# Altium project FOC_Controller_PCB.PrjPcb
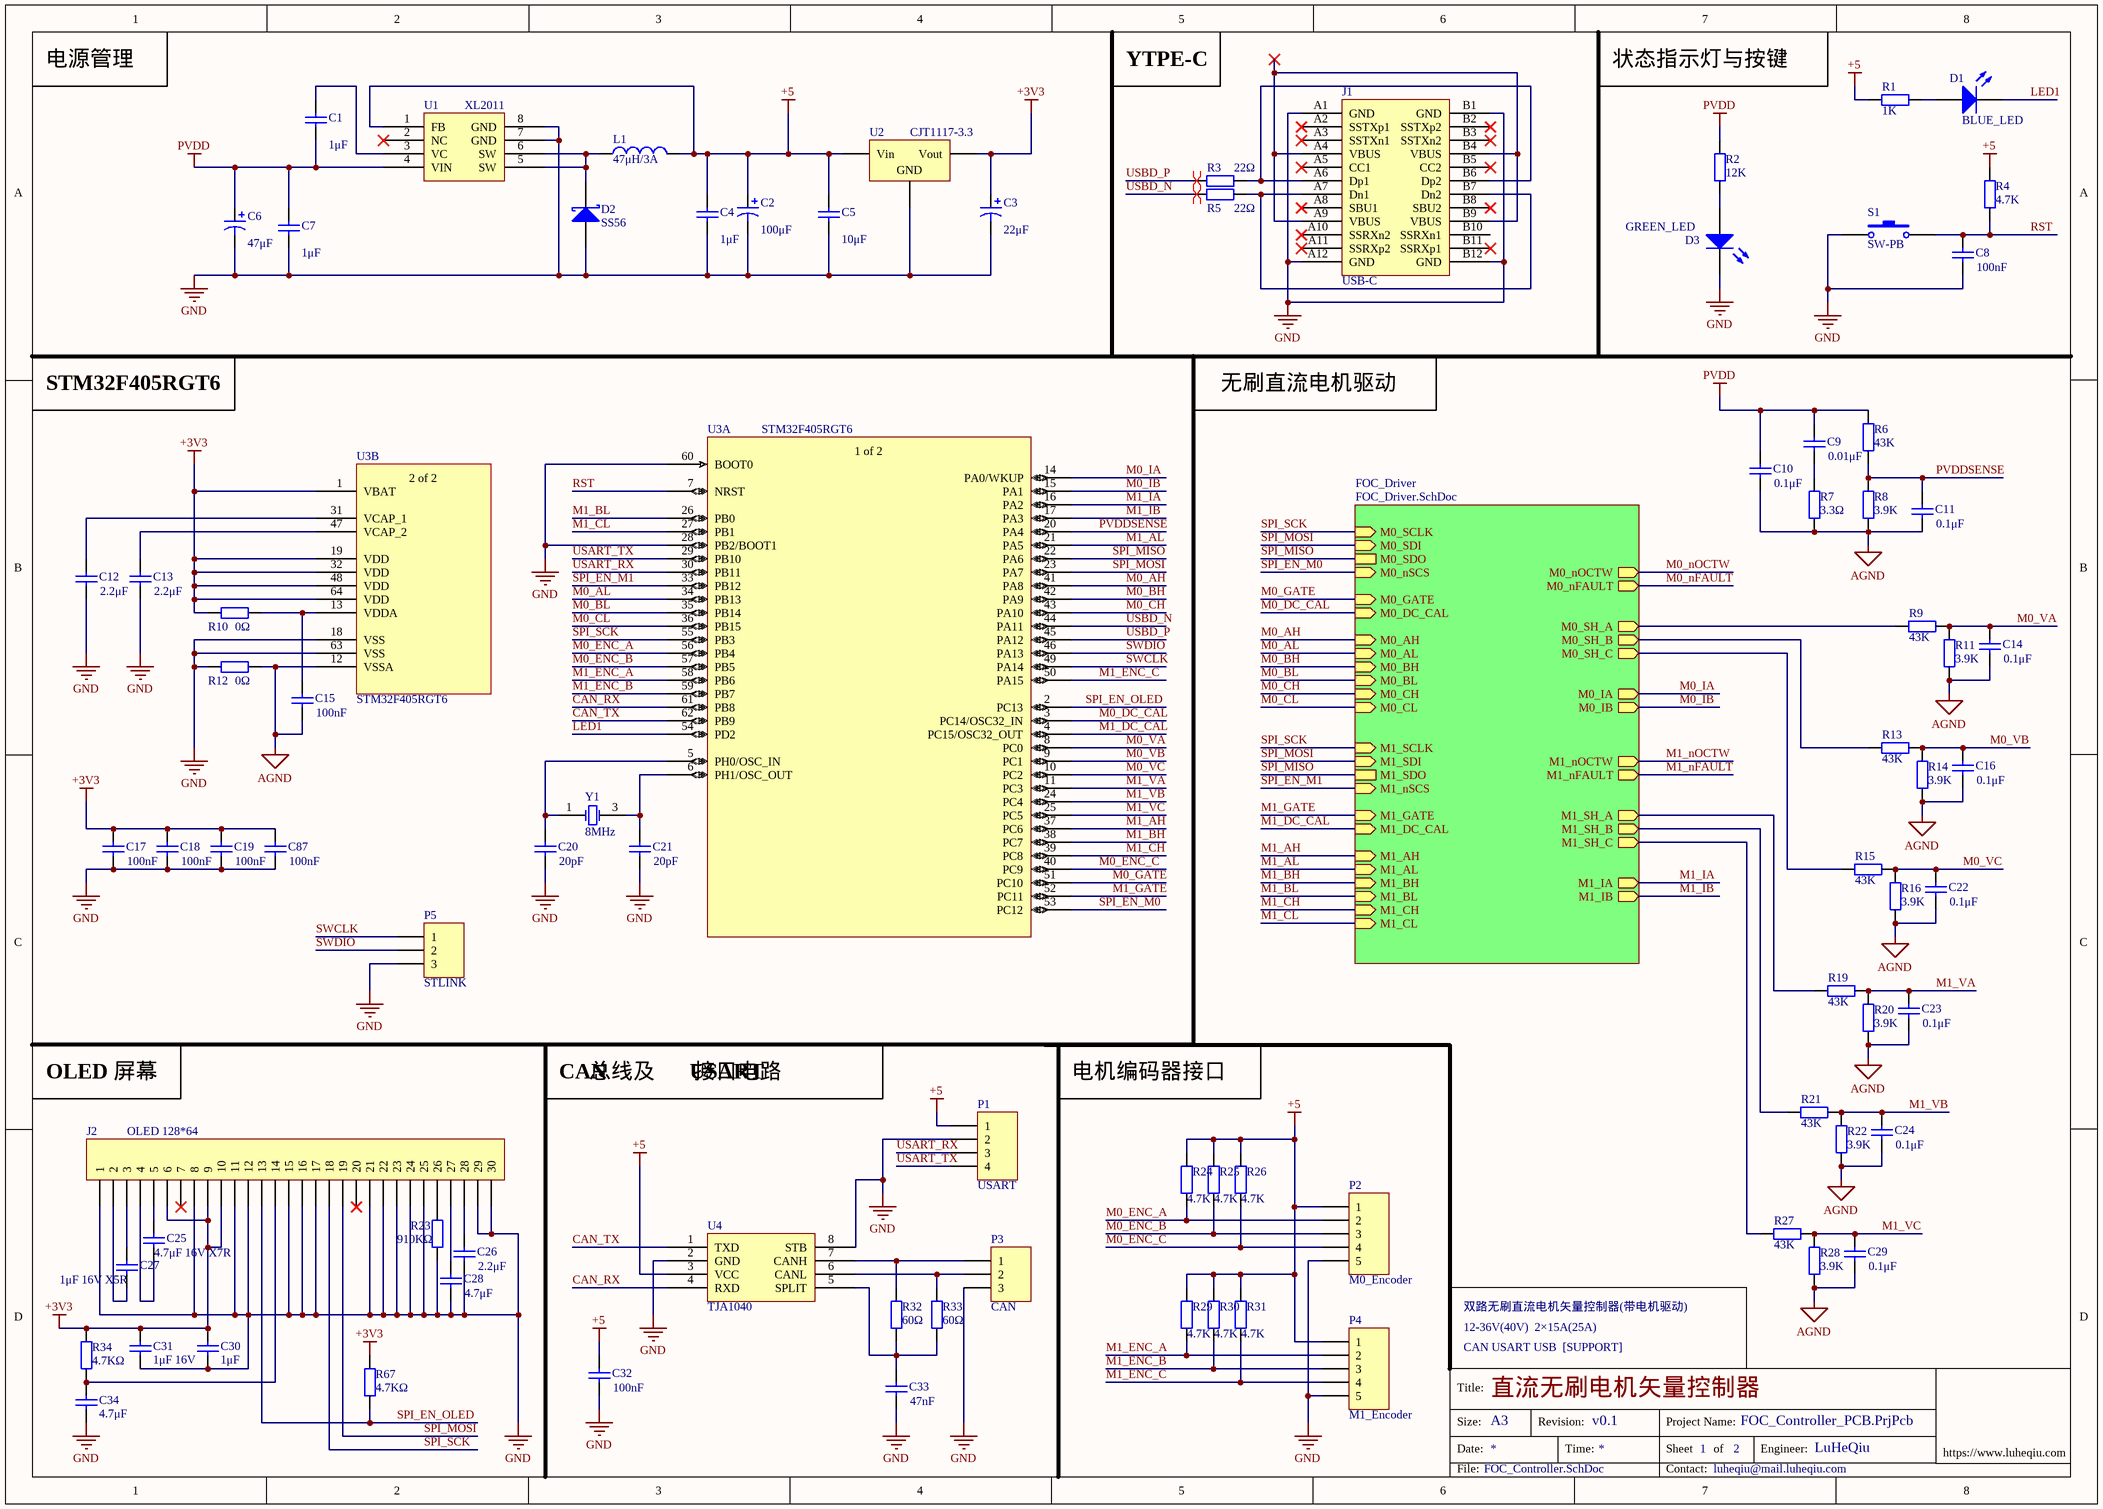
[diagram p0: FOC_Controller.SchDoc]
2 sheets, 190 parts. Net scope: hierarchical (ports join the sheet entries above them; power ports are global).
Board file: FOC_Controller.PcbDoc
Sheets:
  FOC_Controller.SchDoc
    FOC_Driver = FOC_Driver.SchDoc

## Sheet FOC_Controller.SchDoc: 直流无刷电机矢量控制器
size A3; Engineer: LuHeQiu; Revision: v0.1; SheetNumber: 1; SheetTotal: 2; Website1: https://www.luheqiu.com; Website2: https://gitee.com/luheqiu; Description1: 双路无刷直流电机矢量控制器(带电机驱动); Contact: luheqiu@mail.luheqiu.com; Description2: 12-36V(40V)  2×15A(25A); Description3: CAN USART USB  [SUPPORT]

### Parts
C1  value 1μF  [C 0603_L]  (hidden comment: Cap)
C2  value 100μF  [C 1206_M]  (hidden comment: Cap Pol1)
C3  value 22μF  [CD A(3216)]  (hidden comment: Cap Pol1)
C4  value 1μF  [C 0603_L]  (hidden comment: Cap)
C5  value 10μF  [C 0603_M]  (hidden comment: Cap)
C6  value 47μF  [C 1206_M]  (hidden comment: Cap Pol1)
C7  value 1μF  [C 0603_L]  (hidden comment: Cap)
C8  value 100nF  [C 0603_L]  (hidden comment: Cap)
C9  value 0.01μF  [C 0603_L]  (hidden comment: Cap)
C10  value 0.1μF  [C 0603_L]  (hidden comment: Cap)
C11  value 0.1μF  [C 0603_L]  (hidden comment: Cap)
C12  value 2.2μF  [C 0603_L]  (hidden comment: Cap)
C13  value 2.2μF  [C 0603_L]  (hidden comment: Cap)
C14  value 0.1μF  [C 0603_L]  (hidden comment: Cap)
C15  value 100nF  [C 0603_L]  (hidden comment: Cap)
C16  value 0.1μF  [C 0603_L]  (hidden comment: Cap)
C17  value 100nF  [C 0603_L]  (hidden comment: Cap)
C18  value 100nF  [C 0603_L]  (hidden comment: Cap)
C19  value 100nF  [C 0603_L]  (hidden comment: Cap)
C20  value 20pF  [C 0603_L]  (hidden comment: Cap)
C21  value 20pF  [C 0603_L]  (hidden comment: Cap)
C22  value 0.1μF  [C 0603_L]  (hidden comment: Cap)
C23  value 0.1μF  [C 0603_L]  (hidden comment: Cap)
C24  value 0.1μF  [C 0603_L]  (hidden comment: Cap)
C25  value 4.7μF 16V X7R  [C 0603_L]  (hidden comment: Cap)
C26  value 2.2μF  [C 0603_L]  (hidden comment: Cap)
C27  value 1μF 16V X5R  [C 0603_L]  (hidden comment: Cap)
C28  value 4.7μF  [C 0603_L]  (hidden comment: Cap)
C29  value 0.1μF  [C 0603_L]  (hidden comment: Cap)
C30  value 1μF  [C 0603_L]  (hidden comment: Cap)
C31  value 1μF 16V  [C 0603_L]  (hidden comment: Cap)
C32  value 100nF  [C 0603_L]  (hidden comment: Cap)
C33  value 47nF  [C 0603_L]  (hidden comment: Cap)
C34  value 4.7μF  [C 0603_L]  (hidden comment: Cap)
C87  value 100nF  [C 0603_L]  (hidden comment: Cap)
D1  BLUE_LED  [LED 0603B]
D2  SS56  [SMC]
D3  GREEN_LED  [LED 0603G]
J1  USB-C  [USB-C-SMD_TYPE-C-USB-5]
J2  OLED 128*64  [OLED 0.96'' 128x64]
L1  value 47μH/3A  [L-SMD-0630]  (hidden comment: Inductor)
P1  USART  [SIPA04]
P2  M0_Encoder  [SIPB05]
P3  CAN  [SIPA03]
P4  M1_Encoder  [SIPB05]
P5  STLINK  [SIPA03]
R1  value 1K  [R 0603_L]  (hidden comment: Res2)
R2  value 12K  [R 0603_L]  (hidden comment: Res2)
R3  value 22Ω  [R 0603_L]  (hidden comment: Res2)
R4  value 4.7K  [R 0603_L]  (hidden comment: Res2)
R5  value 22Ω  [R 0603_L]  (hidden comment: Res2)
R6  value 43K  [R 0603_L]  (hidden comment: Res2)
R7  value 3.3Ω  [R 0603_L]  (hidden comment: Res2)
R8  value 3.9K  [R 0603_L]  (hidden comment: Res2)
R9  value 43K  [R 0603_L]  (hidden comment: Res2)
R10  value 0Ω  [R 0603_L]  (hidden comment: Res2)
R11  value 3.9K  [R 0603_L]  (hidden comment: Res2)
R12  value 0Ω  [R 0603_L]  (hidden comment: Res2)
R13  value 43K  [R 0603_L]  (hidden comment: Res2)
R14  value 3.9K  [R 0603_L]  (hidden comment: Res2)
R15  value 43K  [R 0603_L]  (hidden comment: Res2)
R16  value 3.9K  [R 0603_L]  (hidden comment: Res2)
R19  value 43K  [R 0603_L]  (hidden comment: Res2)
R20  value 3.9K  [R 0603_L]  (hidden comment: Res2)
R21  value 43K  [R 0603_L]  (hidden comment: Res2)
R22  value 3.9K  [R 0603_L]  (hidden comment: Res2)
R23  value 910KΩ  [R 0603_L]  (hidden comment: Res2)
R24  value 4.7K  [R 0603_L]  (hidden comment: Res2)
R25  value 4.7K  [R 0603_L]  (hidden comment: Res2)
R26  value 4.7K  [R 0603_L]  (hidden comment: Res2)
R27  value 43K  [R 0603_L]  (hidden comment: Res2)
R28  value 3.9K  [R 0603_L]  (hidden comment: Res2)
R29  value 4.7K  [R 0603_L]  (hidden comment: Res2)
R30  value 4.7K  [R 0603_L]  (hidden comment: Res2)
R31  value 4.7K  [R 0603_L]  (hidden comment: Res2)
R32  value 60Ω  [R 0603_L]  (hidden comment: Res2)
R33  value 60Ω  [R 0603_L]  (hidden comment: Res2)
R34  value 4.7KΩ  [R 0603_L]  (hidden comment: Res2)
R67  value 4.7KΩ  [R 0603_L]  (hidden comment: Res2)
S1  SW-PB  [TSW SMD-6*6*5]
U1  XL2011  [SOP8_N]
U2  CJT1117-3.3  [SOT223_N]
U3  STM32F405RGT6  [LQFP64-10x10mm]  (parts A,B of 2)
U4  TJA1040  [SOP8_N]
Y1  8MHz  [OSC 3225-4P]

### Sub-sheets
FOC_Driver = FOC_Driver.SchDoc: M0_SCLK (in), M0_SDI (in), M0_SDO, M0_nSCS (in), M0_DC_CAL (in), M0_GATE (in), M0_AH (in), M0_AL (in), M0_BH (in), M0_BL (in), M0_CH (in), M0_CL (in), M0_SH_C (out), M1_SH_B (out), M0_nFAULT (out), M1_DC_CAL (in), M0_nOCTW (out), M1_nSCS (in), M1_nOCTW (out), M1_AL (in), M1_AH (in), M0_SH_A (out), M1_GATE (in), M1_IA (out), M0_IB (out), M1_IB (out), M1_CH (in), M0_IA (out), M1_SDO, M1_BL (in), M1_SH_A (out), M1_SH_C (out), M1_SCLK (in), M1_SDI (in), M1_nFAULT (out), M0_SH_B (out), M1_BH (in), M1_CL (in)

### Nets
+3V3: C3.1 C17.2 C18.2 C19.2 C30.2 C31.2 C87.2 J2.6 J2.9 J2.10 R10.1 R34.2 R67.1 U2.3(Vout) U3.1(VBAT) U3.19(VDD) U3.32(VDD) U3.48(VDD) U3.64(VDD)
+5: C2.1 C4.2 C5.2 C32.2 L1.2 P1.1 P2.1 P4.1 R1.1 R4.2 R24.2 R25.2 R26.2 R29.2 R30.2 R31.2 U1.1(FB) U2.1(Vin) U4.3(VCC)
AGND: C10.1 C11.1 C14.1 C15.1 C16.1 C22.1 C23.1 C24.1 C29.1 R7.2 R8.2 R11.2 R12.2 R14.2 R16.2 R20.2 R22.2 R28.2 U3.12(VSSA)
GND: C2.2 C3.2 C4.1 C5.1 C6.2 C7.1 C8.1 C12.1 C13.1 C17.1 C18.1 C19.1 C20.1 C21.1 C26.1 C28.1 C30.1 C31.1 C32.1 C33.1 C34.2 C87.1 D2.1(A) D3.2(K) J1.A1(GND) J1.A12(GND) J1.B1(GND) J1.B12(GND) J2.1 J2.8 J2.11 J2.12 J2.15 J2.16 J2.17 J2.21 J2.22 J2.23 J2.24 J2.25 J2.29 J2.30 P1.2 P2.5 P3.3 P4.5 P5.3 R12.1 R23.1 S1.1 U1.7(GND) U1.8(GND) U2.2(GND) U3.18(VSS) U3.28(PB2/BOOT1) U3.60(BOOT0) U3.63(VSS) U4.2(GND) U4.8(STB)
PVDD: C1.1 C6.1 C7.2 C9.2 C10.2 R2.1 R6.1 U1.4(VIN)
CAN_RX: U3.61(PB8) U4.4(RXD)
CAN_TX: U3.62(PB9) U4.1(TXD)
LED1: D1.2(K) U3.54(PD2)
M0_AH: U3.41(PA8) ; sheet FOC_Driver/M0_AH
M0_AL: U3.34(PB13) ; sheet FOC_Driver/M0_AL
M0_BH: U3.42(PA9) ; sheet FOC_Driver/M0_BH
M0_BL: U3.35(PB14) ; sheet FOC_Driver/M0_BL
M0_CH: U3.43(PA10) ; sheet FOC_Driver/M0_CH
M0_CL: U3.36(PB15) ; sheet FOC_Driver/M0_CL
M0_DC_CAL: U3.3(PC14/OSC32_IN) ; sheet FOC_Driver/M0_DC_CAL
M0_ENC_A: P2.2 R24.1 U3.56(PB4)
M0_ENC_B: P2.3 R25.1 U3.57(PB5)
M0_ENC_C: P2.4 R26.1 U3.40(PC9)
M0_GATE: U3.51(PC10) ; sheet FOC_Driver/M0_GATE
M0_IA: U3.14(PA0/WKUP) ; sheet FOC_Driver/M0_IA
M0_IB: U3.15(PA1) ; sheet FOC_Driver/M0_IB
M0_SH_A: R9.1 ; sheet FOC_Driver/M0_SH_A
M0_SH_B: R13.1 ; sheet FOC_Driver/M0_SH_B
M0_SH_C: R15.1 ; sheet FOC_Driver/M0_SH_C
M0_VA: C14.2 R9.2 R11.1 U3.8(PC0)
M0_VB: C16.2 R13.2 R14.1 U3.9(PC1)
M0_VC: C22.2 R15.2 R16.1 U3.10(PC2)
M1_AH: U3.37(PC6) ; sheet FOC_Driver/M1_AH
M1_AL: U3.21(PA5) ; sheet FOC_Driver/M1_AL
M1_BH: U3.38(PC7) ; sheet FOC_Driver/M1_BH
M1_BL: U3.26(PB0) ; sheet FOC_Driver/M1_BL
M1_CH: U3.39(PC8) ; sheet FOC_Driver/M1_CH
M1_CL: U3.27(PB1) ; sheet FOC_Driver/M1_CL
M1_DC_CAL: U3.4(PC15/OSC32_OUT) ; sheet FOC_Driver/M1_DC_CAL
M1_ENC_A: P4.2 R29.1 U3.58(PB6)
M1_ENC_B: P4.3 R30.1 U3.59(PB7)
M1_ENC_C: P4.4 R31.1 U3.50(PA15)
M1_GATE: U3.52(PC11) ; sheet FOC_Driver/M1_GATE
M1_IA: U3.16(PA2) ; sheet FOC_Driver/M1_IA
M1_IB: U3.17(PA3) ; sheet FOC_Driver/M1_IB
M1_SH_A: R19.1 ; sheet FOC_Driver/M1_SH_A
M1_SH_B: R21.1 ; sheet FOC_Driver/M1_SH_B
M1_SH_C: R27.1 ; sheet FOC_Driver/M1_SH_C
M1_VA: C23.2 R19.2 R20.1 U3.11(PC3)
M1_VB: C24.2 R21.2 R22.1 U3.24(PC4)
M1_VC: C29.2 R27.2 R28.1 U3.25(PC5)
PVDDSENSE: C11.2 R6.2 R8.1 U3.20(PA4)
RST: C8.2 R4.1 S1.2 U3.7(NRST)
SPI_EN_M0: U3.53(PC12) ; sheet FOC_Driver/M0_nSCS
SPI_EN_M1: U3.33(PB12) ; sheet FOC_Driver/M1_nSCS
SPI_EN_OLED: J2.13 R67.2 U3.2(PC13)
SPI_MISO: U3.22(PA6) ; sheet FOC_Driver/M0_SDO, sheet FOC_Driver/M1_SDO
SPI_MOSI: J2.19 U3.23(PA7) ; sheet FOC_Driver/M0_SDI, sheet FOC_Driver/M1_SDI
SPI_SCK: J2.18 U3.55(PB3) ; sheet FOC_Driver/M0_SCLK, sheet FOC_Driver/M1_SCLK
SWCLK: P5.1 U3.49(PA14)
SWDIO: P5.2 U3.46(PA13)
USART_RX: P1.3 U3.30(PB11)
USART_TX: P1.4 U3.29(PB10)
USBD_N: R5.1 U3.44(PA11)
USBD_P: R3.1 U3.45(PA12)
NetC1_2: C1.2 U1.3(VC)
NetC9_1: C9.1 R7.1
NetC12_2: C12.2 U3.31(VCAP_1)
NetC13_2: C13.2 U3.47(VCAP_2)
NetC15_2: C15.2 R10.2 U3.13(VDDA)
NetC20_2: C20.2 U3.5(PH0/OSC_IN) Y1.1(OSC1)
NetC21_2: C21.2 U3.6(PH1/OSC_OUT) Y1.3(OSC2)
NetC25_1: C25.1 J2.5
NetC25_2: C25.2 J2.4
NetC26_2: C26.2 J2.28
NetC27_1: C27.1 J2.3
NetC27_2: C27.2 J2.2
NetC28_2: C28.2 J2.27
NetC33_2: C33.2 R32.1 R33.2 U4.5(SPLIT)
NetC34_1: C34.1 J2.14 R34.1
NetD1_1: D1.1(A) R1.2
NetD2_3: D2.3(K) L1.1 U1.5(SW) U1.6(SW)
NetD3_1: D3.1(A) R2.2
NetJ1_A4: J1.A4(VBUS) J1.A9(VBUS) J1.B4(VBUS) J1.B9(VBUS)
NetJ1_A6: J1.A6(Dp1) J1.B6(Dp2) R3.2
NetJ1_A7: J1.A7(Dn1) J1.B7(Dn2) R5.2
NetJ2_26: J2.26 R23.2
NetP3_1: P3.1 R32.2 U4.7(CANH)
NetP3_2: P3.2 R33.1 U4.6(CANL)

Not connected (* = marked no-connect by the designer): J1 A2(SSTXp1)* A3(SSTXn1)* A5(CC1)* A8(SBU1)* A10(SSRXn2)* A11(SSRXp2)* B2(SSTXp2)* B3(SSTXn2)* B5(CC2)* B8(SBU2)* B10(SSRXn1) B11(SSRXp1)*; J2 7* 20*; U1 2(NC)*

### Layout directives
differential pair: USBD_N, USBD_P

### Notes on the sheet
- 电源管理
- YTPE-C
- 状态指示灯与按键
- STM32F405RGT6
- 无刷直流电机驱动
- OLED
- 屏幕
- CAN               USART
- 总线及       接口电路
- 电机编码器接口
- Title:
- Size:
- Date:
- A3
- Revision:
- Time:
- Project Name:
- Sheet
- of
- Engineer:
- File:
- Contact:
- (in symbol STM32F405RGT6, part A) 1 of 2
- (in symbol STM32F405RGT6, part B) 2 of 2

### Library data of the parts
C1 C4 C5 C7-C34 C87 = Cap: Capacitor; Published: 8-Jun-2000; LatestRevisionDate: 17-Jul-2002; LatestRevisionNote: Re-released for DXP Platform.; PackageReference: RAD-0.3; Publisher: Altium Limited; PackageDescription: Radial Cap, Thru-Hole; 2 Leads; 0.3 in Pin Spacing
C2 C3 C6 = Cap Pol1: Polarized Capacitor (Radial); Published: 8-Jun-2000; LatestRevisionDate: 17-Jul-2002; LatestRevisionNote: Re-released for DXP Platform.; PackageReference: RB7.6-15; Publisher: Altium Limited; PackageDescription: Polarized Capacitor (Radial); 2 Leads
D1 D3 = LED2: Typical RED, GREEN, YELLOW, AMBER GaAs LED; Published: 8-Jun-2000; LatestRevisionDate: 17-Jul-2002; LatestRevisionNote: Re-released for DXP Platform.; PackageVersion: Feb-2002; PackageReference: 3.2X1.6X1.1; Publisher: Altium Limited; PackageDescription: SM LED; 2 Flat Leads
D2 = Diode BAS70: Silicon AF Schottky Diode for High-Speed Switching; pin to pad: 3>2; Note: Pin 2 is not connected and not drawn.; Published: 21-Mar-2003; LatestRevisionDate: 29-May-2009; LatestRevisionNote: IPC-7351 Footprint Added.; DatasheetVersion: Oct-1999; PackageVersion: Sep-2001; PackageReference: SOT-23; Publisher: Altium Limited; PackageDescription: 3-Pin SOT-23 Package 0.95 mm Pitch, 2.5 mm Lead Span; ComponentLink1Description: Manufacturer Link; ComponentLink1URL: http://www.infineon.com/; ComponentLink2Description: Datasheet; ComponentLink2URL: http://www.infineon.com/upload/Document/cmc_upload/documents/009/382/bas40_bas140series_1.pdf
J1 = USB-C/S: USB-C型母接口; BOM名称: USB-C型母接口
J2 = Header 30: Header, 30-Pin; LatestRevisionDate: 17-Jul-2002; LatestRevisionNote: Re-released for DXP Platform.; Publisher: Altium Limited
L1 = Inductor: Code_IEC: 1005; Published: 8-Jun-2000; LatestRevisionDate: 29-May-2009; LatestRevisionNote: IPC-7351 Footprint Added.; PackageReference: 0402-A; Publisher: Altium Limited; PackageDescription: Chip Inductor; Code_JEITA: 0402
P1 = Header 4: Header, 4-Pin; LatestRevisionDate: 17-Jul-2002; LatestRevisionNote: Re-released for DXP Platform.; Publisher: Altium Limited
P2 P4 = Header 5: Header, 5-Pin; LatestRevisionDate: 17-Jul-2002; LatestRevisionNote: Re-released for DXP Platform.; Publisher: Altium Limited
P3 P5 = Header 3: Header, 3-Pin; LatestRevisionDate: 17-Jul-2002; LatestRevisionNote: Re-released for DXP Platform.; Publisher: Altium Limited
R1-R16 R19-R34 R67 = Res2: Resistor; Published: 8-Jun-2000; LatestRevisionDate: 17-Jul-2002; LatestRevisionNote: Re-released for DXP Platform.; PackageReference: AXIAL-0.4; Publisher: Altium Limited; PackageDescription: Axial Device, Thru-Hole; 2 Leads; 0.4 in Pin Spacing
S1 = SW-PB: Switch; Published: 24-Mar-1999; LatestRevisionDate: 17-Jul-2002; LatestRevisionNote: Re-released for DXP Platform.; PackageReference: SPST-2; Publisher: Altium Limited; PackageDescription: Switch; 2 Leads
U1 = XL2011: 5V/2.1A DC-DC Buck电源芯片(<50V)
U2 = Volt Reg: Voltage Regulator; Published: 24-Mar-1999; LatestRevisionDate: 29-May-2009; LatestRevisionNote: IPC-7351 Footprint Added.; PackageReference: D2PAK; Publisher: Altium Limited; PackageDescription: 3-Pin Transistor Outline Package 2.54 mm Pitch, 15.1 mm Lead Span
U3 = STM32F405RGT6: No Description Available; Mfr_Name: STMicroelectronics; Copyright: Copyright (C) 2021 Ultra Librarian. All rights reserved.; Manufacturer_Part_Number: STM32F405RGT6; RefDes: RefDes; Type: DEV
U4 = TJA1040: CAN收发器
Y1 = XTAL: Crystal Oscillator; Published: 8-Jun-2000; LatestRevisionDate: 17-Jul-2002; LatestRevisionNote: Re-released for DXP Platform.; PackageReference: R38; Publisher: Altium Limited; PackageDescription: Crystal, Thru-Hole; 2 Leads; Body 3.1 x 8.2 mm (Dia.xH)

## Sheet FOC_Driver.SchDoc: 无刷电机控制器驱动电路
size A3; Engineer: LuHeQiu; Revision: v0.1; SheetNumber: 2; SheetTotal: 2; Website1: https://www.luheqiu.com; Website2: https://gitee.com/luheqiu; Contact: luheqiu@mail.luheqiu.com
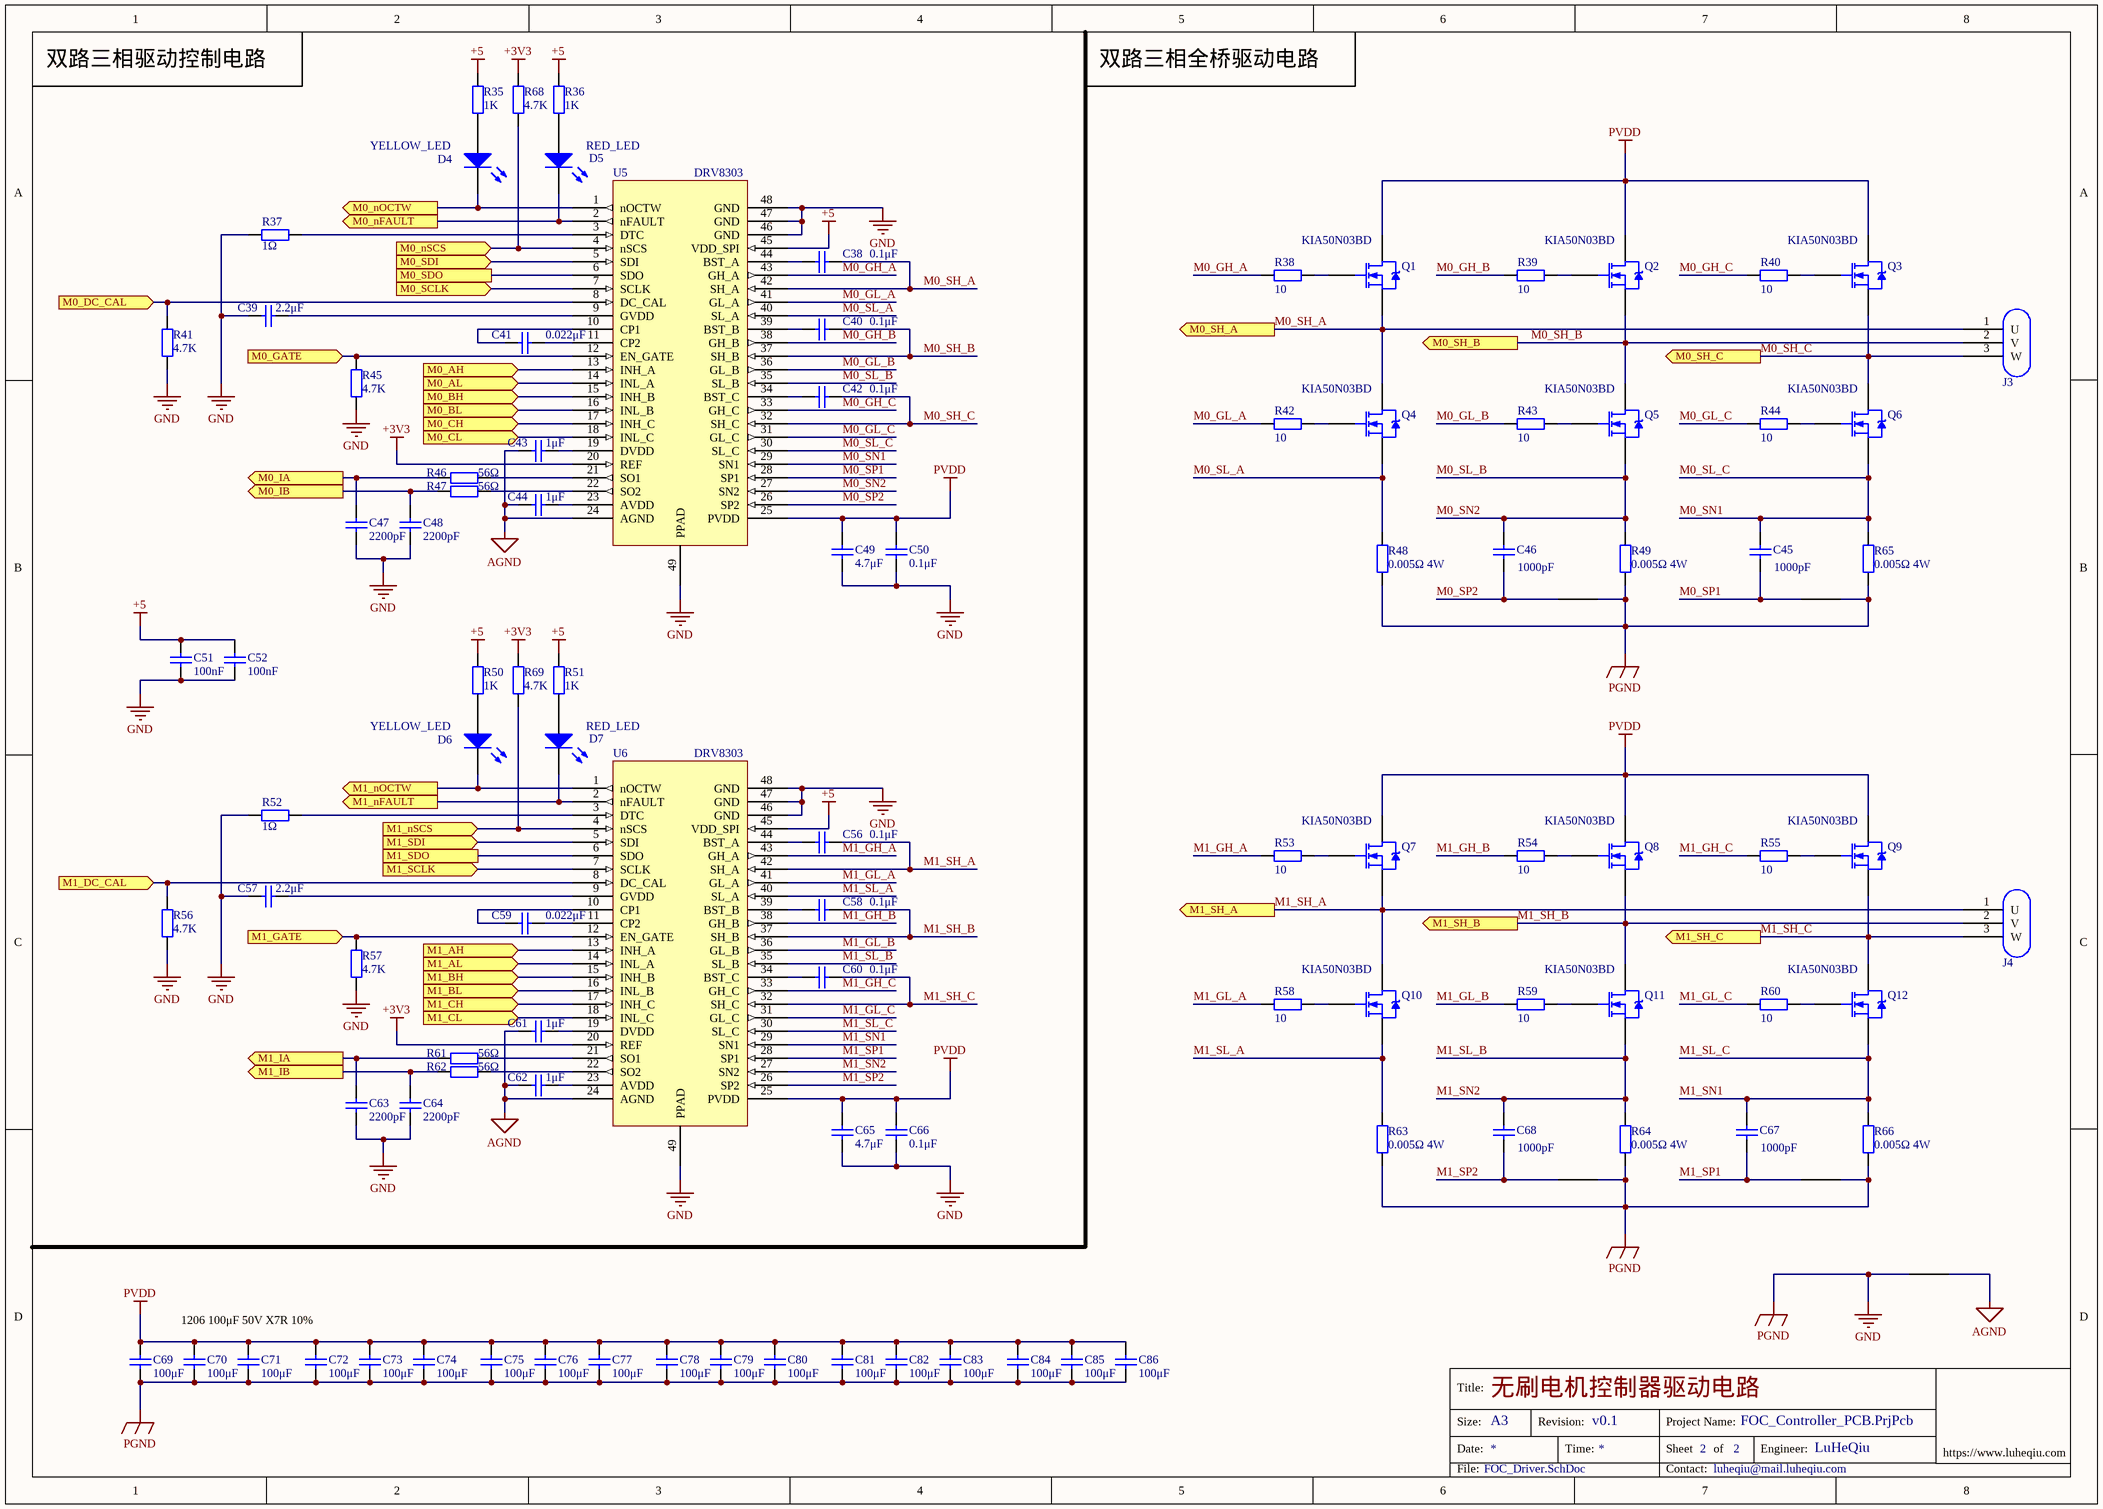
[diagram p1: FOC_Driver.SchDoc]

### Parts
C38  value 0.1μF  [C 0603_L]  (hidden comment: Cap)
C39  value 2.2μF  [C 0603_L]  (hidden comment: Cap)
C40  value 0.1μF  [C 0603_L]  (hidden comment: Cap)
C41  value 0.022μF  [C 0603_L]  (hidden comment: Cap)
C42  value 0.1μF  [C 0603_L]  (hidden comment: Cap)
C43  value 1μF  [C 0603_L]  (hidden comment: Cap)
C44  value 1μF  [C 0603_L]  (hidden comment: Cap)
C45  value 1000pF  [C 0603_L]  (hidden comment: Cap)
C46  value 1000pF  [C 0603_L]  (hidden comment: Cap)
C47  value 2200pF  [C 0603_L]  (hidden comment: Cap)
C48  value 2200pF  [C 0603_L]  (hidden comment: Cap)
C49  value 4.7μF  [C 0603_L]  (hidden comment: Cap)
C50  value 0.1μF  [C 0603_L]  (hidden comment: Cap)
C51  value 100nF  [C 0603_L]  (hidden comment: Cap)
C52  value 100nF  [C 0603_L]  (hidden comment: Cap)
C56  value 0.1μF  [C 0603_L]  (hidden comment: Cap)
C57  value 2.2μF  [C 0603_L]  (hidden comment: Cap)
C58  value 0.1μF  [C 0603_L]  (hidden comment: Cap)
C59  value 0.022μF  [C 0603_L]  (hidden comment: Cap)
C60  value 0.1μF  [C 0603_L]  (hidden comment: Cap)
C61  value 1μF  [C 0603_L]  (hidden comment: Cap)
C62  value 1μF  [C 0603_L]  (hidden comment: Cap)
C63  value 2200pF  [C 0603_L]  (hidden comment: Cap)
C64  value 2200pF  [C 0603_L]  (hidden comment: Cap)
C65  value 4.7μF  [C 0603_L]  (hidden comment: Cap)
C66  value 0.1μF  [C 0603_L]  (hidden comment: Cap)
C67  value 1000pF  [C 0603_L]  (hidden comment: Cap)
C68  value 1000pF  [C 0603_L]  (hidden comment: Cap)
C69  value 100μF  [C 1206_M]  (hidden comment: Cap)
C70  value 100μF  [C 1206_M]  (hidden comment: Cap)
C71  value 100μF  [C 1206_M]  (hidden comment: Cap)
C72  value 100μF  [C 1206_M]  (hidden comment: Cap)
C73  value 100μF  [C 1206_M]  (hidden comment: Cap)
C74  value 100μF  [C 1206_M]  (hidden comment: Cap)
C75  value 100μF  [C 1206_M]  (hidden comment: Cap)
C76  value 100μF  [C 1206_M]  (hidden comment: Cap)
C77  value 100μF  [C 1206_M]  (hidden comment: Cap)
C78  value 100μF  [C 1206_M]  (hidden comment: Cap)
C79  value 100μF  [C 1206_M]  (hidden comment: Cap)
C80  value 100μF  [C 1206_M]  (hidden comment: Cap)
C81  value 100μF  [C 1206_M]  (hidden comment: Cap)
C82  value 100μF  [C 1206_M]  (hidden comment: Cap)
C83  value 100μF  [C 1206_M]  (hidden comment: Cap)
C84  value 100μF  [C 1206_M]  (hidden comment: Cap)
C85  value 100μF  [C 1206_M]  (hidden comment: Cap)
C86  value 100μF  [C 1206_M]  (hidden comment: Cap)
D4  YELLOW_LED  [LED 0603Y]
D5  RED_LED  [LED 0603R]
D6  YELLOW_LED  [LED 0603Y]
D7  RED_LED  [LED 0603R]
J3  三相连接器-插座  [MR30PW-M]  (value not drawn)
J4  三相连接器-插座  [MR30PW-M]  (value not drawn)
NT1  Net Tie  [Net Tie]  (value not drawn)  (net tie, no BOM)
NT2  Net Tie  [Net Tie]  (value not drawn)  (net tie, no BOM)
NT3  Net Tie  [Net Tie]  (value not drawn)  (net tie, no BOM)
NT4  Net Tie  [Net Tie]  (value not drawn)  (net tie, no BOM)
NT5  Net Tie  [Net Tie 40mil]  (value not drawn)  (net tie, no BOM)
Q1  KIA50N03BD  [TO252 - 3]
Q2  KIA50N03BD  [TO252 - 3]
Q3  KIA50N03BD  [TO252 - 3]
Q4  KIA50N03BD  [TO252 - 3]
Q5  KIA50N03BD  [TO252 - 3]
Q6  KIA50N03BD  [TO252 - 3]
Q7  KIA50N03BD  [TO252 - 3]
Q8  KIA50N03BD  [TO252 - 3]
Q9  KIA50N03BD  [TO252 - 3]
Q10  KIA50N03BD  [TO252 - 3]
Q11  KIA50N03BD  [TO252 - 3]
Q12  KIA50N03BD  [TO252 - 3]
R35  value 1K  [R 0603_L]  (hidden comment: Res2)
R36  value 1K  [R 0603_L]  (hidden comment: Res2)
R37  value 1Ω  [R 0603_L]  (hidden comment: Res2)
R38  value 10  [R 0603_L]  (hidden comment: Res2)
R39  value 10  [R 0603_L]  (hidden comment: Res2)
R40  value 10  [R 0603_L]  (hidden comment: Res2)
R41  value 4.7K  [R 0603_L]  (hidden comment: Res2)
R42  value 10  [R 0603_L]  (hidden comment: Res2)
R43  value 10  [R 0603_L]  (hidden comment: Res2)
R44  value 10  [R 0603_L]  (hidden comment: Res2)
R45  value 4.7K  [R 0603_L]  (hidden comment: Res2)
R46  value 56Ω  [R 0603_L]  (hidden comment: Res2)
R47  value 56Ω  [R 0603_L]  (hidden comment: Res2)
R48  value 0.005Ω 4W  [R 2512_M]  (hidden comment: Res2)
R49  value 0.005Ω 4W  [R 2512_M]  (hidden comment: Res2)
R50  value 1K  [R 0603_L]  (hidden comment: Res2)
R51  value 1K  [R 0603_L]  (hidden comment: Res2)
R52  value 1Ω  [R 0603_L]  (hidden comment: Res2)
R53  value 10  [R 0603_L]  (hidden comment: Res2)
R54  value 10  [R 0603_L]  (hidden comment: Res2)
R55  value 10  [R 0603_L]  (hidden comment: Res2)
R56  value 4.7K  [R 0603_L]  (hidden comment: Res2)
R57  value 4.7K  [R 0603_L]  (hidden comment: Res2)
R58  value 10  [R 0603_L]  (hidden comment: Res2)
R59  value 10  [R 0603_L]  (hidden comment: Res2)
R60  value 10  [R 0603_L]  (hidden comment: Res2)
R61  value 56Ω  [R 0603_L]  (hidden comment: Res2)
R62  value 56Ω  [R 0603_L]  (hidden comment: Res2)
R63  value 0.005Ω 4W  [R 2512_M]  (hidden comment: Res2)
R64  value 0.005Ω 4W  [R 2512_M]  (hidden comment: Res2)
R65  value 0.005Ω 4W  [R 2512_M]  (hidden comment: Res2)
R66  value 0.005Ω 4W  [R 2512_M]  (hidden comment: Res2)
R68  value 4.7K  [R 0603_L]  (hidden comment: Res2)
R69  value 4.7K  [R 0603_L]  (hidden comment: Res2)
U5  DRV8303  [DCA48_4P42X3P48]
U6  DRV8303  [DCA48_4P42X3P48]

### Ports
M0_AH (in), M0_AL (in), M0_BH (in), M0_BL (in), M0_CH (in), M0_CL (in), M0_DC_CAL (in), M0_GATE (in), M0_IA (out), M0_IB (out), M0_nFAULT (out), M0_nOCTW (out), M0_nSCS (in), M0_SCLK (in), M0_SDI (in), M0_SDO, M0_SH_A (out), M0_SH_B (out), M0_SH_C (out), M1_AH (in), M1_AL (in), M1_BH (in), M1_BL (in), M1_CH (in), M1_CL (in), M1_DC_CAL (in), M1_GATE (in), M1_IA (out), M1_IB (out), M1_nFAULT (out), M1_nOCTW (out), M1_nSCS (in), M1_SCLK (in), M1_SDI (in), M1_SDO, M1_SH_A (out), M1_SH_B (out), M1_SH_C (out)

### Nets
+3V3: R68.2 R69.2 U5.20(REF) U6.20(REF)
+5: C51.1 C52.1 R35.2 R36.2 R50.2 R51.2 U5.45(VDD_SPI) U6.45(VDD_SPI)
AGND: C43.1 C44.1 C61.1 C62.1 NT5.2 U5.24(AGND) U6.24(AGND)
GND: C39.1 C47.1 C48.1 C49.2 C50.2 C51.2 C52.2 C57.1 C63.1 C64.1 C65.2 C66.2 C69.2 C70.2 C71.2 C72.2 C73.2 C74.2 C75.2 C76.2 C77.2 C78.2 C79.2 C80.2 C81.2 C82.2 C83.2 C84.2 C85.2 C86.2 NT1.2 NT2.2 NT3.2 NT4.2 NT5.1 R37.2 R41.1 R45.1 R48.1 R49.1 R52.2 R56.1 R57.1 R63.1 R64.1 R65.1 R66.1 U5.46(GND) U5.47(GND) U5.48(GND) U5.49(PPAD) U6.46(GND) U6.47(GND) U6.48(GND) U6.49(PPAD)  [also labelled PGND]
PVDD: C49.1 C50.1 C65.1 C66.1 C69.1 C70.1 C71.1 C72.1 C73.1 C74.1 C75.1 C76.1 C77.1 C78.1 C79.1 C80.1 C81.1 C82.1 C83.1 C84.1 C85.1 C86.1 Q1.2(D) Q2.2(D) Q3.2(D) Q7.2(D) Q8.2(D) Q9.2(D) U5.25(PVDD) U6.25(PVDD)
M0_AH: U5.13(INH_A) ; port M0_AH
M0_AL: U5.14(INL_A) ; port M0_AL
M0_BH: U5.15(INH_B) ; port M0_BH
M0_BL: U5.16(INL_B) ; port M0_BL
M0_CH: U5.17(INH_C) ; port M0_CH
M0_CL: U5.18(INL_C) ; port M0_CL
M0_DC_CAL: R41.2 U5.8(DC_CAL) ; port M0_DC_CAL
M0_GATE: R45.2 U5.12(EN_GATE) ; port M0_GATE
M0_GH_A: R38.1 U5.43(GH_A)
M0_GH_B: R39.1 U5.38(GH_B)
M0_GH_C: R40.1 U5.33(GH_C)
M0_GL_A: R42.1 U5.41(GL_A)
M0_GL_B: R43.1 U5.36(GL_B)
M0_GL_C: R44.1 U5.31(GL_C)
M0_IA: C47.2 R46.2 ; port M0_IA
M0_IB: C48.2 R47.2 ; port M0_IB
M0_nFAULT: D5.2(K) U5.2(nFAULT) ; port M0_nFAULT
M0_nOCTW: D4.2(K) U5.1(nOCTW) ; port M0_nOCTW
M0_SH_A: C38.1 J3.1(U) Q1.3(S) Q4.2(D) U5.42(SH_A) ; port M0_SH_A
M0_SH_B: C40.1 J3.2(V) Q2.3(S) Q5.2(D) U5.37(SH_B) ; port M0_SH_B
M0_SH_C: C42.1 J3.3(W) Q3.3(S) Q6.2(D) U5.32(SH_C) ; port M0_SH_C
M0_SL_A: Q4.3(S) R48.2 U5.40(SL_A)
M0_SL_B: C46.2 Q5.3(S) R49.2 U5.27(SN2) U5.35(SL_B)  [also labelled M0_SN2]
M0_SL_C: C45.2 Q6.3(S) R65.2 U5.29(SN1) U5.30(SL_C)  [also labelled M0_SN1]
M0_SP1: C45.1 NT2.1 U5.28(SP1)
M0_SP2: C46.1 NT1.1 U5.26(SP2)
M1_AH: U6.13(INH_A) ; port M1_AH
M1_AL: U6.14(INL_A) ; port M1_AL
M1_BH: U6.15(INH_B) ; port M1_BH
M1_BL: U6.16(INL_B) ; port M1_BL
M1_CH: U6.17(INH_C) ; port M1_CH
M1_CL: U6.18(INL_C) ; port M1_CL
M1_DC_CAL: R56.2 U6.8(DC_CAL) ; port M1_DC_CAL
M1_GATE: R57.2 U6.12(EN_GATE) ; port M1_GATE
M1_GH_A: R53.1 U6.43(GH_A)
M1_GH_B: R54.1 U6.38(GH_B)
M1_GH_C: R55.1 U6.33(GH_C)
M1_GL_A: R58.1 U6.41(GL_A)
M1_GL_B: R59.1 U6.36(GL_B)
M1_GL_C: R60.1 U6.31(GL_C)
M1_IA: C63.2 R61.2 ; port M1_IA
M1_IB: C64.2 R62.2 ; port M1_IB
M1_nFAULT: D7.2(K) U6.2(nFAULT) ; port M1_nFAULT
M1_nOCTW: D6.2(K) U6.1(nOCTW) ; port M1_nOCTW
M1_SH_A: C56.1 J4.1(U) Q7.3(S) Q10.2(D) U6.42(SH_A) ; port M1_SH_A
M1_SH_B: C58.1 J4.2(V) Q8.3(S) Q11.2(D) U6.37(SH_B) ; port M1_SH_B
M1_SH_C: C60.1 J4.3(W) Q9.3(S) Q12.2(D) U6.32(SH_C) ; port M1_SH_C
M1_SL_A: Q10.3(S) R63.2 U6.40(SL_A)
M1_SL_B: C68.2 Q11.3(S) R64.2 U6.27(SN2) U6.35(SL_B)  [also labelled M1_SN2]
M1_SL_C: C67.2 Q12.3(S) R66.2 U6.29(SN1) U6.30(SL_C)  [also labelled M1_SN1]
M1_SP1: C67.1 NT4.1 U6.28(SP1)
M1_SP2: C68.1 NT3.1 U6.26(SP2)
SPI_EN_M0: R68.1 U5.4(nSCS) ; port M0_nSCS
SPI_EN_M1: R69.1 U6.4(nSCS) ; port M1_nSCS
SPI_MISO: U5.6(SDO) U6.6(SDO) ; port M0_SDO, port M1_SDO
SPI_MOSI: U5.5(SDI) U6.5(SDI) ; port M0_SDI, port M1_SDI
SPI_SCK: U5.7(SCLK) U6.7(SCLK) ; port M0_SCLK, port M1_SCLK
NetC38_2: C38.2 U5.44(BST_A)
NetC39_2: C39.2 U5.9(GVDD)
NetC40_2: C40.2 U5.39(BST_B)
NetC41_1: C41.1 U5.11(CP2)
NetC41_2: C41.2 U5.10(CP1)
NetC42_2: C42.2 U5.34(BST_C)
NetC43_2: C43.2 U5.19(DVDD)
NetC44_2: C44.2 U5.23(AVDD)
NetC56_2: C56.2 U6.44(BST_A)
NetC57_2: C57.2 U6.9(GVDD)
NetC58_2: C58.2 U6.39(BST_B)
NetC59_1: C59.1 U6.11(CP2)
NetC59_2: C59.2 U6.10(CP1)
NetC60_2: C60.2 U6.34(BST_C)
NetC61_2: C61.2 U6.19(DVDD)
NetC62_2: C62.2 U6.23(AVDD)
NetD4_1: D4.1(A) R35.1
NetD5_1: D5.1(A) R36.1
NetD6_1: D6.1(A) R50.1
NetD7_1: D7.1(A) R51.1
NetQ1_1: Q1.1(G) R38.2
NetQ2_1: Q2.1(G) R39.2
NetQ3_1: Q3.1(G) R40.2
NetQ4_1: Q4.1(G) R42.2
NetQ5_1: Q5.1(G) R43.2
NetQ6_1: Q6.1(G) R44.2
NetQ7_1: Q7.1(G) R53.2
NetQ8_1: Q8.1(G) R54.2
NetQ9_1: Q9.1(G) R55.2
NetQ10_1: Q10.1(G) R58.2
NetQ11_1: Q11.1(G) R59.2
NetQ12_1: Q12.1(G) R60.2
NetR37_1: R37.1 U5.3(DTC)
NetR46_1: R46.1 U5.21(SO1)
NetR47_1: R47.1 U5.22(SO2)
NetR52_1: R52.1 U6.3(DTC)
NetR61_1: R61.1 U6.21(SO1)
NetR62_1: R62.1 U6.22(SO2)

### Notes on the sheet
- 双路三相驱动控制电路
- 双路三相全桥驱动电路
- 1206 100μF 50V X7R 10%
- Title:
- Size:
- Date:
- A3
- Revision:
- Time:
- Project Name:
- Sheet
- of
- Engineer:
- File:
- Contact:

### Library data of the parts
C38-C52 C56-C86 = Cap: Capacitor; Published: 8-Jun-2000; LatestRevisionDate: 17-Jul-2002; LatestRevisionNote: Re-released for DXP Platform.; PackageReference: RAD-0.3; Publisher: Altium Limited; PackageDescription: Radial Cap, Thru-Hole; 2 Leads; 0.3 in Pin Spacing
D4-D7 = LED2: as D1 on sheet FOC_Controller; Published: 8-Jun-2000; LatestRevisionDate: 17-Jul-2002; LatestRevisionNote: Re-released for DXP Platform.; PackageVersion: Feb-2002; PackageReference: 3.2X1.6X1.1; Publisher: Altium Limited; PackageDescription: SM LED; 2 Flat Leads
Q1-Q12 = N-MOSFET
R35-R66 R68 R69 = Res2: Resistor; Published: 8-Jun-2000; LatestRevisionDate: 17-Jul-2002; LatestRevisionNote: Re-released for DXP Platform.; PackageReference: AXIAL-0.4; Publisher: Altium Limited; PackageDescription: Axial Device, Thru-Hole; 2 Leads; 0.4 in Pin Spacing
U5 U6 = DRV8303: THREE PHASE PRE-DRIVER WITH DUAL CURRENT SHUNT AMPLIFIERS, DCA0048A

## Nets that join several sheets
+3V3: FOC_Controller (19 pins), FOC_Driver (R68.2 R69.2 U5.20 U6.20)
+5: FOC_Controller (19 pins), FOC_Driver (8 pins)
AGND: FOC_Controller (19 pins), FOC_Driver (7 pins)
GND: FOC_Controller (59 pins), FOC_Driver (55 pins)
PVDD: FOC_Controller (8 pins), FOC_Driver (30 pins)
M0_AH: FOC_Controller (U3.41), FOC_Driver (U5.13)
M0_AL: FOC_Controller (U3.34), FOC_Driver (U5.14)
M0_BH: FOC_Controller (U3.42), FOC_Driver (U5.15)
M0_BL: FOC_Controller (U3.35), FOC_Driver (U5.16)
M0_CH: FOC_Controller (U3.43), FOC_Driver (U5.17)
M0_CL: FOC_Controller (U3.36), FOC_Driver (U5.18)
M0_DC_CAL: FOC_Controller (U3.3), FOC_Driver (R41.2 U5.8)
M0_GATE: FOC_Controller (U3.51), FOC_Driver (R45.2 U5.12)
M0_IA: FOC_Controller (U3.14), FOC_Driver (C47.2 R46.2)
M0_IB: FOC_Controller (U3.15), FOC_Driver (C48.2 R47.2)
M0_SH_A: FOC_Controller (R9.1), FOC_Driver (5 pins)
M0_SH_B: FOC_Controller (R13.1), FOC_Driver (5 pins)
M0_SH_C: FOC_Controller (R15.1), FOC_Driver (5 pins)
M1_AH: FOC_Controller (U3.37), FOC_Driver (U6.13)
M1_AL: FOC_Controller (U3.21), FOC_Driver (U6.14)
M1_BH: FOC_Controller (U3.38), FOC_Driver (U6.15)
M1_BL: FOC_Controller (U3.26), FOC_Driver (U6.16)
M1_CH: FOC_Controller (U3.39), FOC_Driver (U6.17)
M1_CL: FOC_Controller (U3.27), FOC_Driver (U6.18)
M1_DC_CAL: FOC_Controller (U3.4), FOC_Driver (R56.2 U6.8)
M1_GATE: FOC_Controller (U3.52), FOC_Driver (R57.2 U6.12)
M1_IA: FOC_Controller (U3.16), FOC_Driver (C63.2 R61.2)
M1_IB: FOC_Controller (U3.17), FOC_Driver (C64.2 R62.2)
M1_SH_A: FOC_Controller (R19.1), FOC_Driver (5 pins)
M1_SH_B: FOC_Controller (R21.1), FOC_Driver (5 pins)
M1_SH_C: FOC_Controller (R27.1), FOC_Driver (5 pins)
SPI_EN_M0: FOC_Controller (U3.53), FOC_Driver (R68.1 U5.4)
SPI_EN_M1: FOC_Controller (U3.33), FOC_Driver (R69.1 U6.4)
SPI_MISO: FOC_Controller (U3.22), FOC_Driver (U5.6 U6.6)
SPI_MOSI: FOC_Controller (J2.19 U3.23), FOC_Driver (U5.5 U6.5)
SPI_SCK: FOC_Controller (J2.18 U3.55), FOC_Driver (U5.7 U6.7)